# Altium schematic sheet Final Design.SchDoc
size A0; Organization: Altium Limited; Address1: L3, 12a Rodborough Rd; Address2: Frenchs Forest; Address3: NSW; Address4: Australia 2086
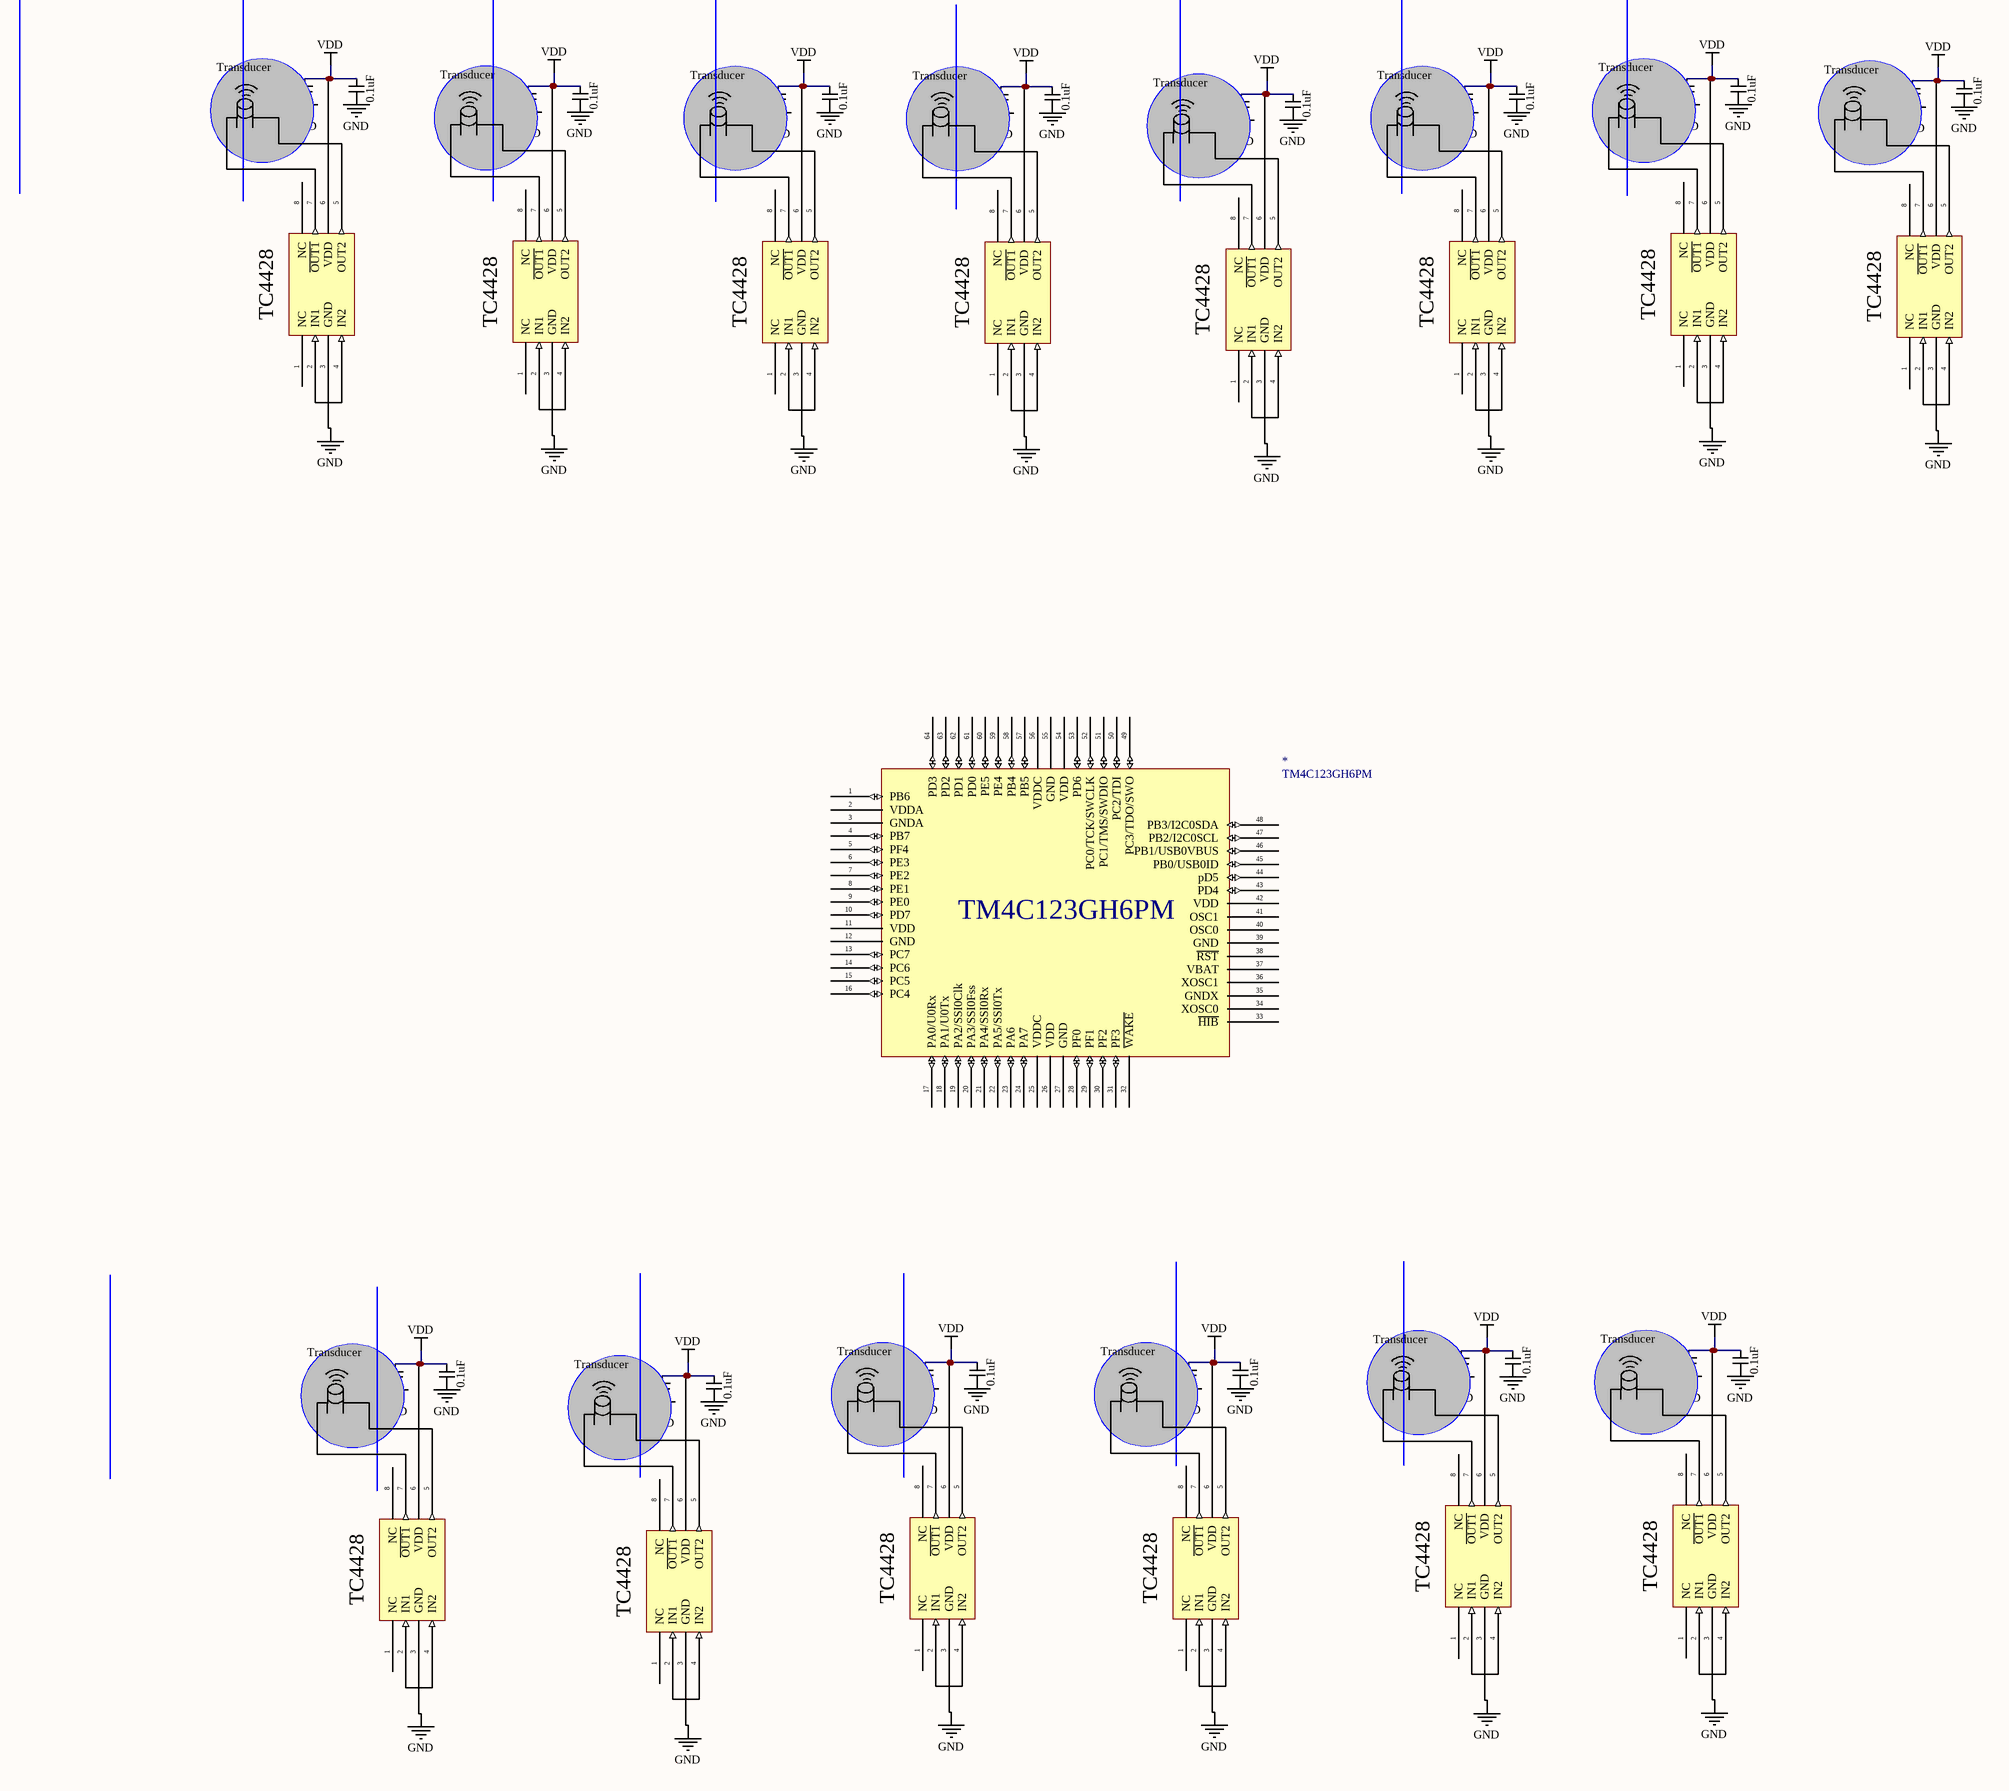
[diagram p0: Final Design.SchDoc]

## Parts
(Parts that share a designator on the sheet are numbered #1, #2 ... from top to bottom, then left to right.)
*  TM4C123GH6PM
*?#1  4.7uF
*?#2  0.1uF
*?#3  4.7uF
*?#4  0.1uF
*?#5  4.7uF
*?#6  0.1uF
*?#7  4.7uF
*?#8  0.1uF
*?#9  4.7uF
*?#10  0.1uF
*?#11  4.7uF
*?#12  0.1uF
*?#13  4.7uF
*?#14  0.1uF
*?#15  4.7uF
*?#16  0.1uF
*?#17  Transducer
*?#18  Transducer
*?#19  Transducer
*?#20  Transducer
*?#21  Transducer
*?#22  Transducer
*?#23  Transducer
*?#24  Transducer
*?#25  TC4428
*?#26  TC4428
*?#27  TC4428
*?#28  TC4428
*?#29  TC4428
*?#30  TC4428
*?#31  TC4428
*?#32  TC4428
*?#33  4.7uF
*?#34  0.1uF
*?#35  4.7uF
*?#36  0.1uF
*?#37  4.7uF
*?#38  0.1uF
*?#39  4.7uF
*?#40  0.1uF
*?#41  4.7uF
*?#42  0.1uF
*?#43  4.7uF
*?#44  0.1uF
*?#45  Transducer
*?#46  Transducer
*?#47  Transducer
*?#48  Transducer
*?#49  Transducer
*?#50  Transducer
*?#51  TC4428
*?#52  TC4428
*?#53  TC4428
*?#54  TC4428
*?#55  TC4428
*?#56  TC4428

## Nets
GND: *?#1.?2 *?#2.?2 *?#3.?2 *?#4.?2 *?#5.?2 *?#6.?2 *?#7.?2 *?#8.?2 *?#9.?2 *?#10.?2 *?#11.?2 *?#12.?2 *?#13.?2 *?#14.?2 *?#15.?2 *?#16.?2 *?#25.3(GND) *?#26.3(GND) *?#27.3(GND) *?#28.3(GND) *?#29.3(GND) *?#30.3(GND) *?#31.3(GND) *?#32.3(GND) *?#33.?2 *?#34.?2 *?#35.?2 *?#36.?2 *?#37.?2 *?#38.?2 *?#39.?2 *?#40.?2 *?#41.?2 *?#42.?2 *?#43.?2 *?#44.?2 *?#51.3(GND) *?#52.3(GND) *?#53.3(GND) *?#54.3(GND) *?#55.3(GND) *?#56.3(GND)
VDD: *?#1.?1 *?#2.?1 *?#3.?1 *?#4.?1 *?#5.?1 *?#6.?1 *?#7.?1 *?#8.?1 *?#9.?1 *?#10.?1 *?#11.?1 *?#12.?1 *?#13.?1 *?#14.?1 *?#15.?1 *?#16.?1 *?#25.6(VDD) *?#26.6(VDD) *?#27.6(VDD) *?#28.6(VDD) *?#29.6(VDD) *?#30.6(VDD) *?#31.6(VDD) *?#32.6(VDD) *?#33.?1 *?#34.?1 *?#35.?1 *?#36.?1 *?#37.?1 *?#38.?1 *?#39.?1 *?#40.?1 *?#41.?1 *?#42.?1 *?#43.?1 *?#44.?1 *?#51.6(VDD) *?#52.6(VDD) *?#53.6(VDD) *?#54.6(VDD) *?#55.6(VDD) *?#56.6(VDD)
Net*?#17_?1: *?#17.?1 *?#25.5(OUT2)
Net*?#17_?2: *?#17.?2 *?#25.7(~{OUT1})
Net*?#18_?1: *?#18.?1 *?#26.5(OUT2)
Net*?#18_?2: *?#18.?2 *?#26.7(~{OUT1})
Net*?#19_?1: *?#19.?1 *?#31.5(OUT2)
Net*?#19_?2: *?#19.?2 *?#31.7(~{OUT1})
Net*?#20_?1: *?#20.?1 *?#27.5(OUT2)
Net*?#20_?2: *?#20.?2 *?#27.7(~{OUT1})
Net*?#21_?1: *?#21.?1 *?#28.5(OUT2)
Net*?#21_?2: *?#21.?2 *?#28.7(~{OUT1})
Net*?#22_?1: *?#22.?1 *?#29.5(OUT2)
Net*?#22_?2: *?#22.?2 *?#29.7(~{OUT1})
Net*?#23_?1: *?#23.?1 *?#30.5(OUT2)
Net*?#23_?2: *?#23.?2 *?#30.7(~{OUT1})
Net*?#24_?1: *?#24.?1 *?#32.5(OUT2)
Net*?#24_?2: *?#24.?2 *?#32.7(~{OUT1})
Net*?#25_2: *?#25.2(IN1) *?#25.4(IN2)
Net*?#26_2: *?#26.2(IN1) *?#26.4(IN2)
Net*?#27_2: *?#27.2(IN1) *?#27.4(IN2)
Net*?#28_2: *?#28.2(IN1) *?#28.4(IN2)
Net*?#29_2: *?#29.2(IN1) *?#29.4(IN2)
Net*?#30_2: *?#30.2(IN1) *?#30.4(IN2)
Net*?#31_2: *?#31.2(IN1) *?#31.4(IN2)
Net*?#32_2: *?#32.2(IN1) *?#32.4(IN2)
Net*?#45_?1: *?#45.?1 *?#52.5(OUT2)
Net*?#45_?2: *?#45.?2 *?#52.7(~{OUT1})
Net*?#46_?1: *?#46.?1 *?#51.5(OUT2)
Net*?#46_?2: *?#46.?2 *?#51.7(~{OUT1})
Net*?#47_?1: *?#47.?1 *?#55.5(OUT2)
Net*?#47_?2: *?#47.?2 *?#55.7(~{OUT1})
Net*?#48_?1: *?#48.?1 *?#53.5(OUT2)
Net*?#48_?2: *?#48.?2 *?#53.7(~{OUT1})
Net*?#49_?1: *?#49.?1 *?#54.5(OUT2)
Net*?#49_?2: *?#49.?2 *?#54.7(~{OUT1})
Net*?#50_?1: *?#50.?1 *?#56.5(OUT2)
Net*?#50_?2: *?#50.?2 *?#56.7(~{OUT1})
Net*?#51_2: *?#51.2(IN1) *?#51.4(IN2)
Net*?#52_2: *?#52.2(IN1) *?#52.4(IN2)
Net*?#53_2: *?#53.2(IN1) *?#53.4(IN2)
Net*?#54_2: *?#54.2(IN1) *?#54.4(IN2)
Net*?#55_2: *?#55.2(IN1) *?#55.4(IN2)
Net*?#56_2: *?#56.2(IN1) *?#56.4(IN2)

Not connected (* = marked no-connect by the designer): * 1(PB6) 2(VDDA) 3(GNDA) 4(PB7) 5(PF4) 6(PE3) 7(PE2) 8(PE1) 9(PE0) 10(PD7) 11(VDD) 12(GND) 13(PC7) 14(PC6) 15(PC5) 16(PC4) 17(PA0/U0Rx) 18(PA1/U0Tx) 19(PA2/SSI0Clk) 20(PA3/SSI0Fss) 21(PA4/SSI0Rx) 22(PA5/SSI0Tx) 23(PA6) 24(PA7) 25(VDDC) 26(VDD) 27(GND) 28(PF0) 29(PF1) 30(PF2) 31(PF3) 32(~{WAKE}) 33(~{HIB}) 34(XOSC0) 35(GNDX) 36(XOSC1) 37(VBAT) 38(~{RST}) 39(GND) 40(OSC0) 41(OSC1) 42(VDD) 43(PD4) 44(pD5) 45(PB0/USB0ID) 46(PB1/USB0VBUS) 47(PB2/I2C0SCL) 48(PB3/I2C0SDA) 49(PC3/TDO/SWO) 50(PC2/TDI) 51(PC1/TMS/SWDIO) 52(PC0/TCK/SWCLK) 53(PD6) 54(VDD) 55(GND) 56(VDDC) 57(PB5) 58(PB4) 59(PE4) 60(PE5) 61(PD0) 62(PD1) 63(PD2) 64(PD3); *?#25 1(NC) 8(NC); *?#26 1(NC) 8(NC); *?#27 1(NC) 8(NC); *?#28 1(NC) 8(NC); *?#29 1(NC) 8(NC); *?#30 1(NC) 8(NC); *?#31 1(NC) 8(NC); *?#32 1(NC) 8(NC); *?#51 1(NC) 8(NC); *?#52 1(NC) 8(NC); *?#53 1(NC) 8(NC); *?#54 1(NC) 8(NC); *?#55 1(NC) 8(NC); *?#56 1(NC) 8(NC)

## Notes on the sheet
- Title
- Size:
- Date:
- File:
- A0
- Number:
- Time:
- Revision:
- Sheet
- of

## Library data of the parts
* = TM4C123GH6PM: IC MCU 32BIT 256KB FLASH 64LQFP
*?#1-*?#16 *?#33-*?#44 = Capacitor
*?#25-*?#32 *?#51-*?#56 = TC4428: Dual High-Speed Power MOSFET Drivers